# Altium schematic sheet SWAP_21DD__LV_DR_BRUSH_REV1_0.SchDoc
size 297 x 210 mm
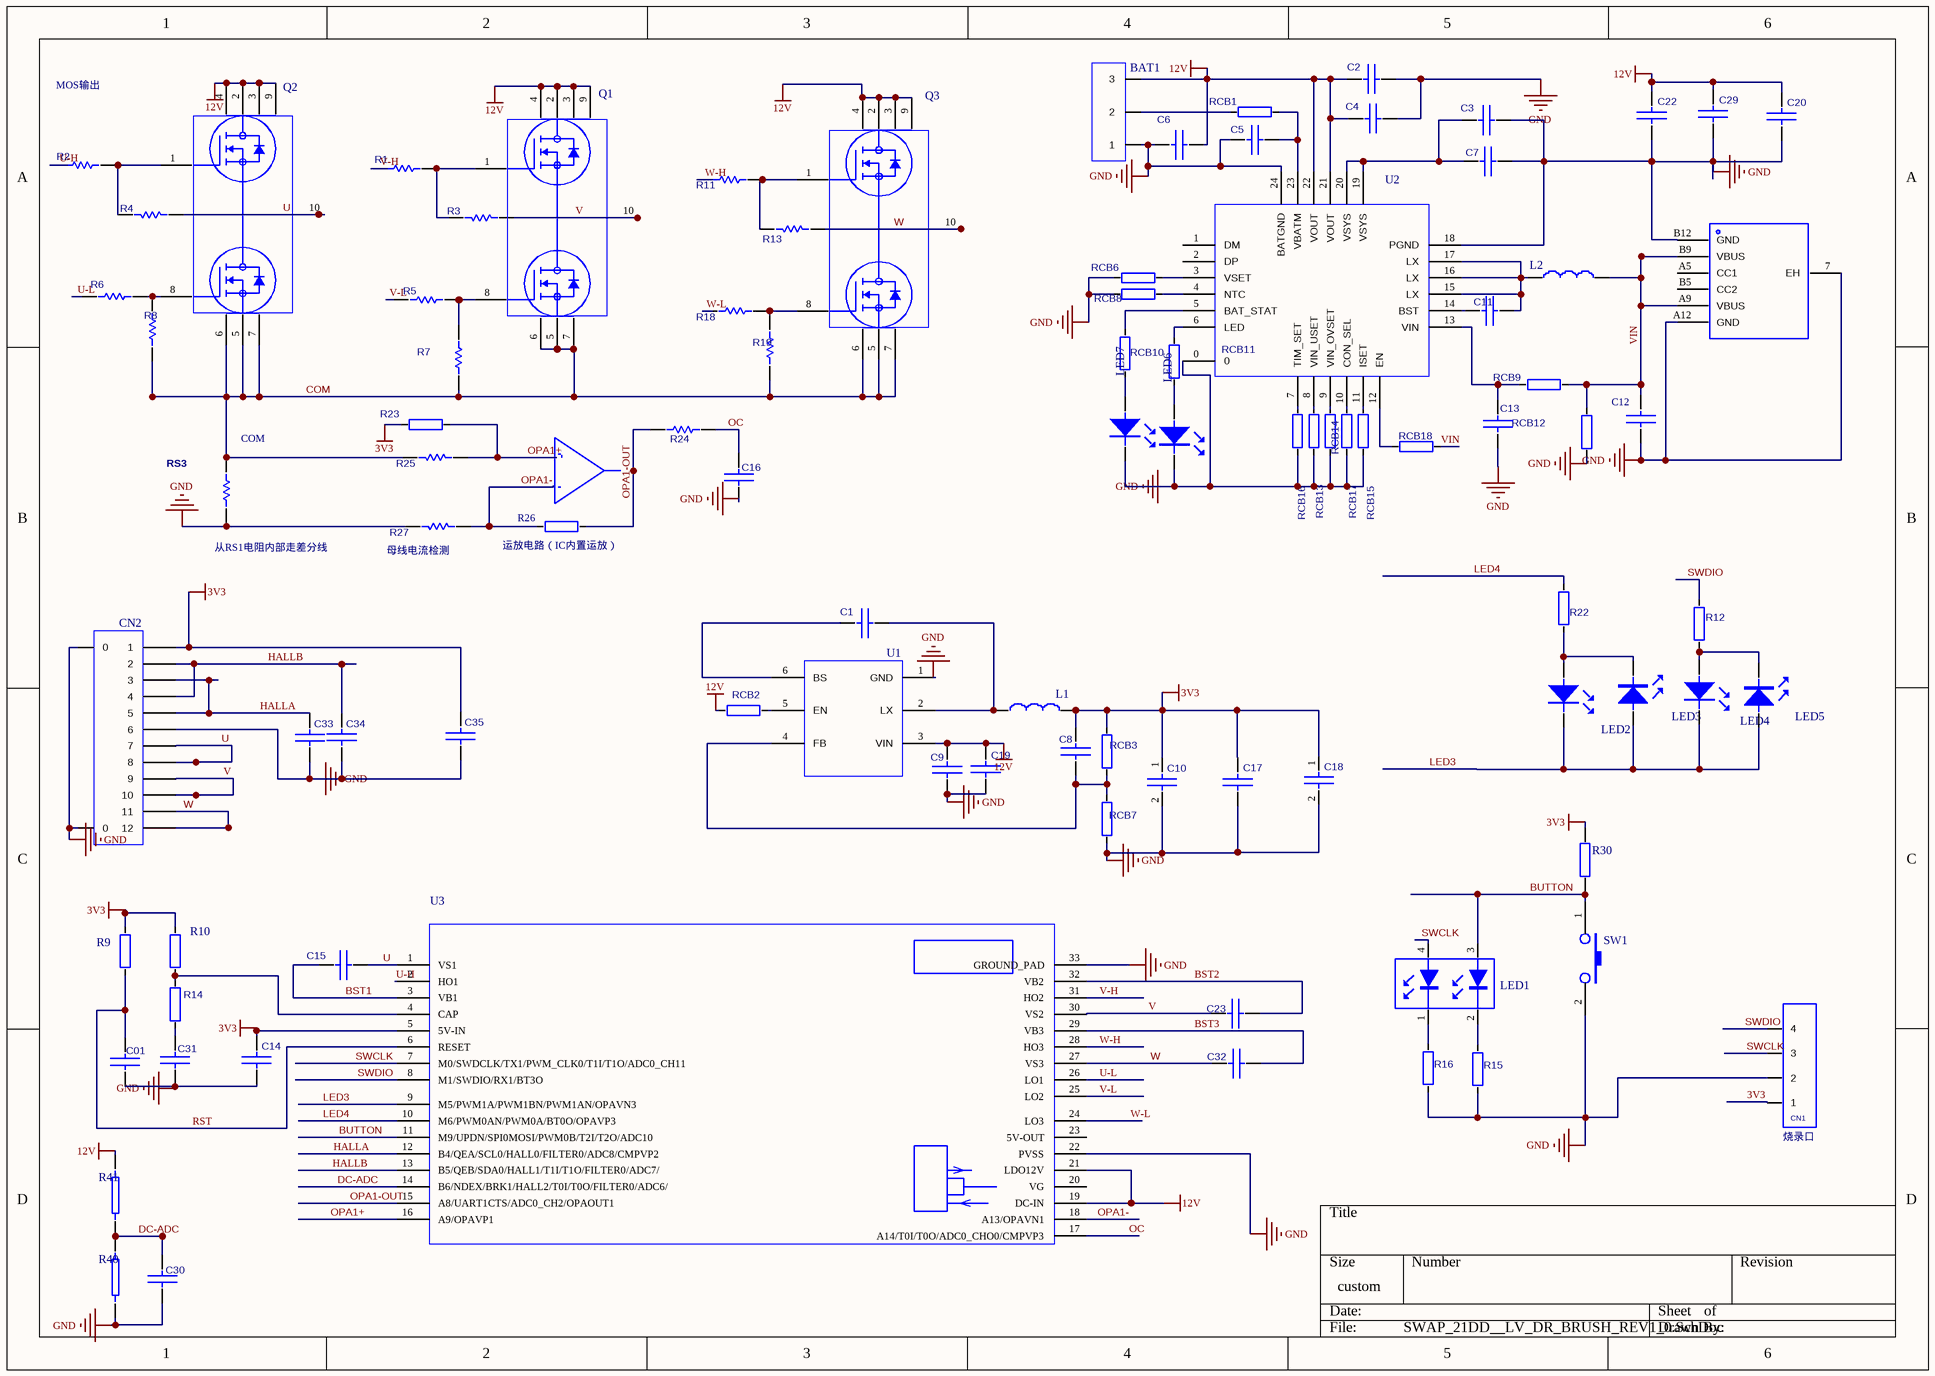
[diagram p0: SWAP_21DD__LV_DR_BRUSH_REV1_0.SchDoc]

## Parts
BAT1  BAT  [HDR1X3]  (value not drawn)
C1  CC  [C0402]  (value not drawn)
C01  CC  [C0402]  (value not drawn)
C2  CC  [LC-0603_C]  (value not drawn)
C3  CC  [C0603]  (value not drawn)
C4  CC  [C0603]  (value not drawn)
C5  CC  [C0402]  (value not drawn)
C6  CC  [C0402]  (value not drawn)
C7  CC  [C0603]  (value not drawn)
C8  CC  [C0402]  (value not drawn)
C9  CC  [C0603]  (value not drawn)
C10  CC  [C0603]  (value not drawn)
C11  CC  [C0402]  (value not drawn)
C12  CC  [LC-0402_C]  (value not drawn)
C13  CC  [LC-0402_C]  (value not drawn)
C14  CC  [C0402]  (value not drawn)
C15  CC  [C0603]  (value not drawn)
C16  CC  [C0402]  (value not drawn)
C17  CC  [C0603]  (value not drawn)
C18  CC  [C0603]  (value not drawn)
C19  CC  [C0603]  (value not drawn)
C20  CC  [C0603]  (value not drawn)
C22  CC  [C0603]  (value not drawn)
C23  CC  [C0603]  (value not drawn)
C29  CC  [C0603]  (value not drawn)
C30  CC  [C0402]  (value not drawn)
C31  CC  [C0402]  (value not drawn)
C32  CC  [C0603]  (value not drawn)
C33  CC  [C0603]  (value not drawn)
C34  CC  [C0603]  (value not drawn)
C35  CC  [C0603]  (value not drawn)
CN1  4P-2.54-8  [XH2.54-SMD4P]  (value not drawn)
CN2  CON12  [SMD-12]  (value not drawn)
L1  L_-_5X4  [L_0805]  (value not drawn)
L2  L_-_5X4  [L1206]  (value not drawn)
LED1  LED-1  [LED0402-4]  (value not drawn)
LED2  LED  [LED0402]  (value not drawn)
LED3  LED  [LED0402]  (value not drawn)
LED4  LED  [LED0402]  (value not drawn)
LED5  LED  [LED0402]  (value not drawn)
LED6  LED  [LED0402]  (value not drawn)
LED7  LED  [LED0402]  (value not drawn)
Q1  CJBM3020  [DFN-3X3_8]  (value not drawn)
Q2  CJBM3020  [DFN-3X3_8]  (value not drawn)
Q3  CJBM3020  [DFN-3X3_8]  (value not drawn)
R1  RES_SEMI  [LC-0402_R]  (value not drawn)
R2  RES_SEMI  [LC-0402_R]  (value not drawn)
R3  RES_SEMI  [LC-0402_R]  (value not drawn)
R4  RES_SEMI  [LC-0402_R]  (value not drawn)
R5  RES_SEMI  [LC-0402_R]  (value not drawn)
R6  RES_SEMI  [LC-0402_R]  (value not drawn)
R7  RES_SEMI  [LC-0402_R]  (value not drawn)
R8  RES_SEMI  [LC-0402_R]  (value not drawn)
R9  RR  [R0402]  (value not drawn)
R10  RR  [R0402]  (value not drawn)
R11  RES_SEMI  [LC-0402_R]  (value not drawn)
R12  RR  [R0402]  (value not drawn)
R13  RES_SEMI  [LC-0402_R]  (value not drawn)
R14  R0603  [R0402]  (value not drawn)
R15  RR  [R0402]  (value not drawn)
R16  RR  [R0402]  (value not drawn)
R18  RES_SEMI  [LC-0402_R]  (value not drawn)
R19  RES_SEMI  [LC-0402_R]  (value not drawn)
R22  RR  [R0402]  (value not drawn)
R23  R0402  [LC-0402_R]  (value not drawn)
R24  RES_SEMI  [LC-0402_R]  (value not drawn)
R25  RES_SEMI  [LC-0402_R]  (value not drawn)
R26  R0402  [LC-0402_R]  (value not drawn)
R27  RES_SEMI  [LC-0402_R]  (value not drawn)
R30  R  [LC-0402_R]  (value not drawn)
R40  RES1  [LC-0402_R]  (value not drawn)
R41  RES1  [LC-0402_R]  (value not drawn)
RCB1  RR  [LC-0402_R]  (value not drawn)
RCB2  RR  [LC-0402_R]  (value not drawn)
RCB3  R0603  [R0402]  (value not drawn)
RCB6  RR  [LC-0402_R]  (value not drawn)
RCB7  R0603  [R0402]  (value not drawn)
RCB8  RR  [LC-0402_R]  (value not drawn)
RCB9  R0603  [R0402]  (value not drawn)
RCB10  RR  [LC-0402_R]  (value not drawn)
RCB11  RR  [LC-0402_R]  (value not drawn)
RCB12  RR  [LC-0402_R]  (value not drawn)
RCB13  RR  [LC-0402_R]  (value not drawn)
RCB14  R0603  [0603R]  (value not drawn)
RCB15  RR  [LC-0402_R]  (value not drawn)
RCB16  RR  [LC-0402_R]  (value not drawn)
RCB17  RR  [LC-0402_R]  (value not drawn)
RCB18  RR  [LC-0402_R]  (value not drawn)
RS3  RES_2512  [LC-0805_R]  (value not drawn)
SW1  SW-PB  [SW_SMD-3_6_2.5]  (value not drawn)
U1  TP8204HS  [LC-SOT-23-6]  (value not drawn)
U2  IP2326  [QFN-24]  (value not drawn)
U3  SWM21DK6U7_QFN32_5X5_BA00  [SWM21DK6U7_QFN32_5X5_BA00]  (value not drawn)
USB1  TYPE-C_6P  [TYPE-C-SMD_6P]  (value not drawn)

## Nets
3V3: C8.1 C10.1 C14.1 C17.1 C18.1 C35.1 CN1.1 CN2.1 L1.2 R9.1 R10.1 R23.2 R30.1 RCB3.2 U3.5(5V-IN)
12V: BAT1.3 C2.2 C4.2 C6.1 C9.1 C19.1 C20.1 C22.1 C29.1 Q1.2(D1) Q1.3(D1) Q1.4(D1) Q1.9(D1) Q2.2(D1) Q2.3(D1) Q2.4(D1) Q2.9(D1) Q3.2(D1) Q3.3(D1) Q3.4(D1) Q3.9(D1) R41.2 RCB2.1 U1.3(VIN) U2.21(VOUT) U2.22(VOUT) U3.19(DC-IN) U3.21(LDO12V)
GND: BAT1.1 C01.1 C2.1 C3.1 C4.1 C5.2 C6.2 C7.1 C9.2 C10.2 C12.2 C13.2 C14.2 C16.1 C17.2 C18.2 C19.2 C20.2 C22.2 C29.2 C30.1 C31.1 C33.2 C34.2 C35.2 CN1.2 CN2.0 CN2.6 LED6.2 LED7.2 R15.2 R16.2 R27.1 R40.1 RCB6.2 RCB7.1 RCB8.2 RCB12.2 RCB13.2 RCB14.2 RCB15.2 RCB16.2 RCB17.2 RS3.1 SW1.2 U1.1(GND) U2.0 U2.18(PGND) U2.24(BATGND) U3.22(PVSS) U3.33(GROUND_PAD) USB1.7(EH) USB1.A12(GND) USB1.B12(GND)
BST1: C15.1 U3.3(VB1)
BST2: C23.1 U3.32(VB2)
BST3: C32.1 U3.29(VB3)
BUTTON: LED1.3 R30.2 SW1.1 U3.11(M9/UPDN/SPI0MOSI/PWM0B/T2I/T2O/ADC10)
COM: Q1.5(S2) Q1.6(S2) Q1.7(S2) Q2.5(S2) Q2.6(S2) Q2.7(S2) Q3.5(S2) Q3.6(S2) Q3.7(S2) R7.1 R8.1 R19.1 R25.1 RS3.2
DC-ADC: C30.2 R40.2 R41.1 U3.14(B6/NDEX/BRK1/HALL2/T0I/T0O/FILTER0/ADC6/)
HALLA: C33.1 CN2.3 CN2.5 U3.12(B4/QEA/SCL0/HALL0/FILTER0/ADC8/CMPVP2)
HALLB: C34.1 CN2.2 CN2.4 U3.13(B5/QEB/SDA0/HALL1/T1I/T1O/FILTER0/ADC7/)
LED3: LED2.2 LED3.1 LED4.2 LED5.1 U3.9(M5/PWM1A/PWM1BN/PWM1AN/OPAVN3)
LED4: R22.2 U3.10(M6/PWM0AN/PWM0A/BT0O/OPAVP3)
OC: C16.2 R24.2 U3.17(A14/T0I/T0O/ADC0_CHO0/CMPVP3)
OPA1+: R23.1 R25.2 U3.16(A9/OPAVP1)
OPA1-: R26.2 R27.2 U3.18(A13/OPAVN1)
OPA1-OUT: R24.1 R26.1 U3.15(A8/UART1CTS/ADC0_CH2/OPAOUT1)
RST: C01.2 R9.2 U3.6(RESET)
SWCLK: CN1.3 LED1.4 U3.7(M0/SWDCLK/TX1/PWM_CLK0/T1I/T1O/ADC0_CH11)
SWDIO: CN1.4 R12.2 U3.8(M1/SWDIO/RX1/BT3O)
U: C15.2 CN2.7 CN2.8 Q2.10(S1/D2) R4.2 U3.1(VS1)
U-H: R2.1 U3.2(HO1)
U-L: R6.1 U3.26(LO1)
V: C23.2 CN2.9 CN2.10 Q1.10(S1/D2) R3.1 U3.30(VS2)
V-H: R1.1 U3.31(HO2)
V-L: R5.1 U3.25(LO2)
VIN: C12.1 L2.1 RCB9.2 RCB12.1 RCB18.2 USB1.A9(VBUS) USB1.B9(VBUS)
W: C32.2 CN2.11 CN2.12 Q3.10(S1/D2) R13.1 U3.27(VS3)
W-H: R11.1 U3.28(HO3)
W-L: R18.1 U3.24(LO3)
NetBAT1_2: BAT1.2 RCB1.2
NetC1_1: C1.1 L1.1 U1.2(LX)
NetC1_2: C1.2 U1.6(BS)
NetC3_2: C3.2 C7.2 U2.19(VSYS) U2.20(VSYS)
NetC5_1: C5.1 RCB1.1 U2.23(VBATM)
NetC8_2: C8.2 RCB3.1 RCB7.2 U1.4(FB)
NetC11_1: C11.1 U2.14(BST)
NetC11_2: C11.2 L2.2 U2.15(LX) U2.16(LX) U2.17(LX)
NetC13_1: C13.1 RCB9.1 U2.13(VIN)
NetC31_2: C31.2 R14.2
NetLED1_1: LED1.1 R16.1
NetLED1_2: LED1.2 R15.1
NetLED2_1: LED2.1 LED3.2 R22.1
NetLED4_1: LED4.1 LED5.2 R12.1
NetLED6_1: LED6.1 RCB11.1
NetLED7_1: LED7.1 RCB10.1
NetQ1_1: Q1.1(G1) R1.2 R3.2
NetQ1_8: Q1.8(G2) R5.2 R7.2
NetQ2_1: Q2.1(G1) R2.2 R4.1
NetQ2_8: Q2.8(G2) R6.2 R8.2
NetQ3_1: Q3.1(G1) R11.2 R13.2
NetQ3_8: Q3.8(G2) R18.2 R19.2
NetR10_2: R10.2 R14.1 U3.4(CAP)
NetRCB2_2: RCB2.2 U1.5(EN)
NetRCB6_1: RCB6.1 U2.3(VSET)
NetRCB8_1: RCB8.1 U2.4(NTC)
NetRCB10_2: RCB10.2 U2.5(BAT_STAT)
NetRCB11_2: RCB11.2 U2.6(LED)
NetRCB13_1: RCB13.1 U2.8(VIN_USET)
NetRCB14_1: RCB14.1 U2.9(VIN_OVSET)
NetRCB15_1: RCB15.1 U2.11(ISET)
NetRCB16_1: RCB16.1 U2.7(TIM_SET)
NetRCB17_1: RCB17.1 U2.10(CON_SEL)
NetRCB18_1: RCB18.1 U2.12(EN)

Not connected (* = marked no-connect by the designer): U2 1(DM) 2(DP); U3 20(VG) 23(5V-OUT); USB1 A5(CC1) B5(CC2)

## Notes on the sheet
- MOS输出
- (near RS3) COM
- (near RS3) 从RS1电阻内部走差分线
- (near R27) 母线电流检测
- (near R26) 运放电路（IC内置运放）
- (near CN1) 烧录口

## Library data of the parts
BAT1 = BAT: Connector; PCB DECAL: HDR1X3
C1 C2 C5 C6 C8 C11-C13 = CC: Capacitor; PCB_DECAL: C0603
  C1 C5 C6 C8 C11: PCB DECAL: C0402
  C2: PCB DECAL: LC-0603_C
  C12 C13: PCB DECAL: LC-0402_C
C3 C4 C7 C9 C10 C18 C20 C22 C29 C33-C35 = CC: Capacitor; PCB_DECAL: C0603; PCB DECAL: C0603
C15 C23 C32 = CC: Capacitor; Part_Shape: 0603; Value: 2.2uF; Source_Path: E:\GTCS-A01-SWM-P9项目\GTCS-A01-SWM-P9项目V1.2\GTCS-A01-SWM-P9-V1.2.原理图\99.DSN; Published: 8-Jun-2000; LatestRevisionDate: 17-Jul-2002; LatestRevisionNote: Re-released for DXP Platform.; PackageReference: RAD-0.3; Publisher: Altium Limited; PackageDescription: Radial Cap, Thru-Hole; 2 Leads; 0.3 in Pin Spacing; PCB DECAL: C0603
C16 = CC: 贴片瓷片电容; Value: 100nF; PCB_DECAL: C0603; Published: 8-Jun-2000; LatestRevisionDate: 17-Jul-2002; LatestRevisionNote: Re-released for DXP Platform.; PackageReference: RAD-0.3; Publisher: Altium Limited; Comment_1: C0603; PCB DECAL: C0402
C30 = CC: PCB_DECAL: C0603; Comment_1: CAP_S; PCB DECAL: C0402
CN1 = 4P-2.54-8: 接插件  DS-5.1CN4  DS-2.54CWB-4; PCB_DECAL: 4P-2.54-8; Comment_1: 4P-2.54-8; PCB DECAL: XH2.54-SMD4P
CN2 = CON12: Connector; PCB DECAL: SMD-12
L1 L2 = L_-_5X4: 电感
  L1: PCB DECAL: L_0805
  L2: PCB DECAL: L1206
R1-R8 R11 R13 R18 R19 R24 R25 R27 = RES_SEMI: Semiconductor Resistor; Value: 1K; PCB_DECAL: R0603; Published: 8-Jun-2000; LatestRevisionDate: 17-Jul-2002; LatestRevisionNote: Re-released for DXP Platform.; PackageReference: AXIAL-0.5; Publisher: Altium Limited; PackageDescription: Axial Device, Thru-Hole; 2 Leads; 0.5 in Pin Spacing; Comment_1: RES_SEMI; PCB DECAL: LC-0402_R
R9 R10 R12 R15 R16 R22 = RR: 贴片 电阻器; SMD/DIP/WELDING: SMD; PCB DECAL: R0402
R14 = R0603: 贴片 电阻器; SMD/DIP/WELDING: SMD; PCB DECAL: R0402
R23 R26 = R0402: 贴片电阻; Value: 1K; PCB_DECAL: R0603; Published: 8-Jun-2000; LatestRevisionDate: 17-Jul-2002; LatestRevisionNote: Re-released for DXP Platform.; PackageReference: AXIAL-0.5; Publisher: Altium Limited; PackageDescription: Axial Device, Thru-Hole; 2 Leads; 0.5 in Pin Spacing; Comment_1: R0402; PCB DECAL: LC-0402_R
R30 = R: Resistance; PCB DECAL: LC-0402_R
RCB1 RCB2 RCB6 RCB8 RCB10-RCB13 RCB15-RCB18 = RR: 贴片 电阻器; Value: 1K; PCB_DECAL: R0603; SMD/DIP/WELDING: SMD; Published: 8-Jun-2000; LatestRevisionDate: 17-Jul-2002; LatestRevisionNote: Re-released for DXP Platform.; PackageReference: AXIAL-0.5; Publisher: Altium Limited; PackageDescription: Axial Device, Thru-Hole; 2 Leads; 0.5 in Pin Spacing; PCB DECAL: LC-0402_R
RCB3 RCB7 RCB9 RCB14 = R0603: 贴片 电阻器; Value: 1K; SMD/DIP/WELDING: SMD; Published: 8-Jun-2000; LatestRevisionDate: 17-Jul-2002; LatestRevisionNote: Re-released for DXP Platform.; PackageReference: AXIAL-0.5; Publisher: Altium Limited; PackageDescription: Axial Device, Thru-Hole; 2 Leads; 0.5 in Pin Spacing; PCB_DECAL: R0603
  RCB3 RCB7 RCB9: PCB DECAL: R0402
  RCB14: PCB DECAL: 0603R
RS3 = RES_2512: Semiconductor Resistor; Value: 1K; PCB_DECAL: 2512R_6332; Published: 8-Jun-2000; LatestRevisionDate: 17-Jul-2002; LatestRevisionNote: Re-released for DXP Platform.; PackageReference: AXIAL-0.5; Publisher: Altium Limited; PackageDescription: Axial Device, Thru-Hole; 2 Leads; 0.5 in Pin Spacing; Comment_1: RES_2512; PCB DECAL: LC-0805_R
U3 = SWM21DK6U7_QFN32_5X5_BA00: 微控制器, Cortex-M0系列; PCB DECAL: SWM21DK6U7_QFN32_5X5_BA00
USB1 = TYPE-C_6P: Manufacturer: SHOU HAN(首韩); Symbol: TYPE-C 6P(073); Add_into_BOM: yes; Connector_Type: Type-C; Gender: 母; Number_of_Ports: 1; Number_of_Contacts: 6P; Mounting_Style: 卧贴; Current_Rating___Power_(Max): 5A; Operating_Temperature_Range: -25℃~+85℃; Device: TYPE-C 6P(073); Supplier: LCSC; Supplier_Part: C668623; Manufacturer_Part: TYPE-C 6P(073); JLCPCB_Part_Class: Extended Part; LCSC_Part_Name: Type-C 母 卧贴; Supplier_Footprint: SMD; Datasheet: https://atta.szlcsc.com/upload/public/pdf/source/20200618/C668623_A4B260DED7AC1949BAC6AE39E9F4CD80.pdf; Convert_to_PCB: yes; Standard: -; PCB DECAL: TYPE-C-SMD_6P
C01 C14 C17 C19 C31 = CC
  C01 C14 C31: PCB DECAL: C0402
  C17 C19: PCB DECAL: C0603
LED1 = LED-1: PCB DECAL: LED0402-4
LED2-LED7 = LED: PCB DECAL: LED0402
Q1-Q3 = CJBM3020: PCB DECAL: DFN-3X3_8
R40 R41 = RES1: PCB DECAL: LC-0402_R
SW1 = SW-PB: PCB DECAL: SW_SMD-3_6_2.5
U1 = TP8204HS: PCB DECAL: LC-SOT-23-6
U2 = IP2326: PCB DECAL: QFN-24